# Altium schematic sheet Voltage_Division.SchDoc
size A4
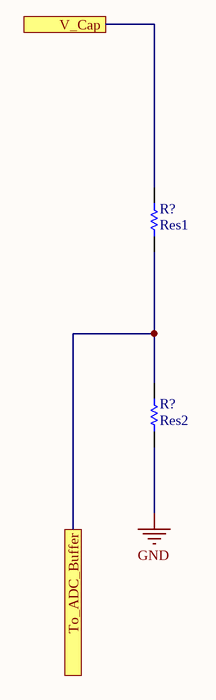
[diagram p0: Voltage_Division.SchDoc]

## Parts
(Parts that share a designator on the sheet are numbered #1, #2 ... from top to bottom, then left to right.)
R?#1  Res1  [AXIAL-0.3]
R?#2  Res2  [AXIAL-0.3]

## Ports
To_ADC_Buffer, V_Cap

## Nets
GND: R?#2.1
To_ADC_Buffer: R?#1.1 R?#2.2 ; port To_ADC_Buffer
V_Cap: R?#1.2 ; port V_Cap

## Library data of the parts
R?#1 R?#2 = Res1: Resistor; Published: 8-Jun-2000; LatestRevisionDate: 17-Jul-2002; LatestRevisionNote: Re-released for DXP Platform.; PackageReference: AXIAL-0.3; Publisher: Altium Limited; PackageDescription: Axial Device, Thru-Hole; 2 Leads; 0.3 in Pin Spacing